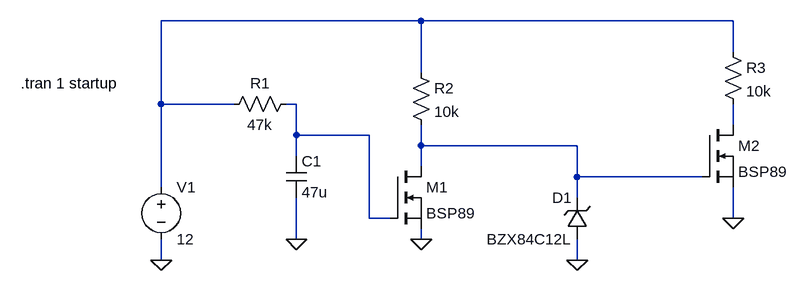
[diagram p0: schematic StartupCirc.asc]
StartupCirc.asc, the LTspice schematic file:
Version 4
SHEET 1 1208 680
WIRE 528 -224 128 -224
WIRE 1008 -224 528 -224
WIRE 1008 -176 1008 -224
WIRE 528 -144 528 -224
WIRE 128 -96 128 -224
WIRE 240 -96 128 -96
WIRE 336 -96 320 -96
WIRE 1008 -64 1008 -96
WIRE 336 -48 336 -96
WIRE 448 -48 336 -48
WIRE 528 -32 528 -64
WIRE 768 -32 528 -32
WIRE 336 -16 336 -48
WIRE 528 0 528 -32
WIRE 768 16 768 -32
WIRE 960 16 768 16
WIRE 128 32 128 -96
WIRE 768 48 768 16
WIRE 448 80 448 -48
WIRE 480 80 448 80
WIRE 1008 80 1008 32
WIRE 336 112 336 48
WIRE 528 112 528 96
WIRE 128 144 128 112
WIRE 768 144 768 112
FLAG 336 112 0
FLAG 128 144 0
FLAG 528 112 0
FLAG 1008 80 0
FLAG 768 144 0
SYMBOL voltage 128 16 R0
WINDOW 123 0 0 Left 0
WINDOW 39 0 0 Left 0
SYMATTR InstName V1
SYMATTR Value 12
SYMBOL res 336 -112 R90
WINDOW 0 0 56 VBottom 2
WINDOW 3 32 56 VTop 2
SYMATTR InstName R1
SYMATTR Value 47k
SYMBOL cap 320 -16 R0
SYMATTR InstName C1
SYMATTR Value 47u
SYMBOL nmos 480 0 R0
SYMATTR InstName M1
SYMATTR Value BSP89
SYMBOL res 512 -160 R0
SYMATTR InstName R2
SYMATTR Value 10k
SYMBOL nmos 960 -64 R0
SYMATTR InstName M2
SYMATTR Value BSP89
SYMBOL zener 784 112 R180
WINDOW 0 24 64 Left 2
WINDOW 3 24 0 Left 2
SYMATTR InstName D1
SYMATTR Value BZX84C12L
SYMBOL res 992 -192 R0
SYMATTR InstName R3
SYMATTR Value 10k
TEXT -88 -128 Left 2 !.tran 1 startup

The netlist it stands for:
* StartupCirc.asc
V1 N001 0 12
R1 N002 N001 47k
C1 N002 0 47u
M1 N004 N002 0 0 BSP89
R2 N001 N004 10k
M2 N003 N004 0 0 BSP89
D1 0 N004 BZX84C12L
R3 N001 N003 10k
.model D D
.lib standard.dio
.model NMOS NMOS
.model PMOS PMOS
.lib standard.mos
.tran 1 startup
.backanno
.end